# Altium schematic sheet POWER.SchDoc: XC7A3G-REGULATORS
size A4; Date: 9 AUG 2026; Engineer: Parsa Malekpour; Revision: 1.0.0; SheetNumber: 9; SheetTotal: 18
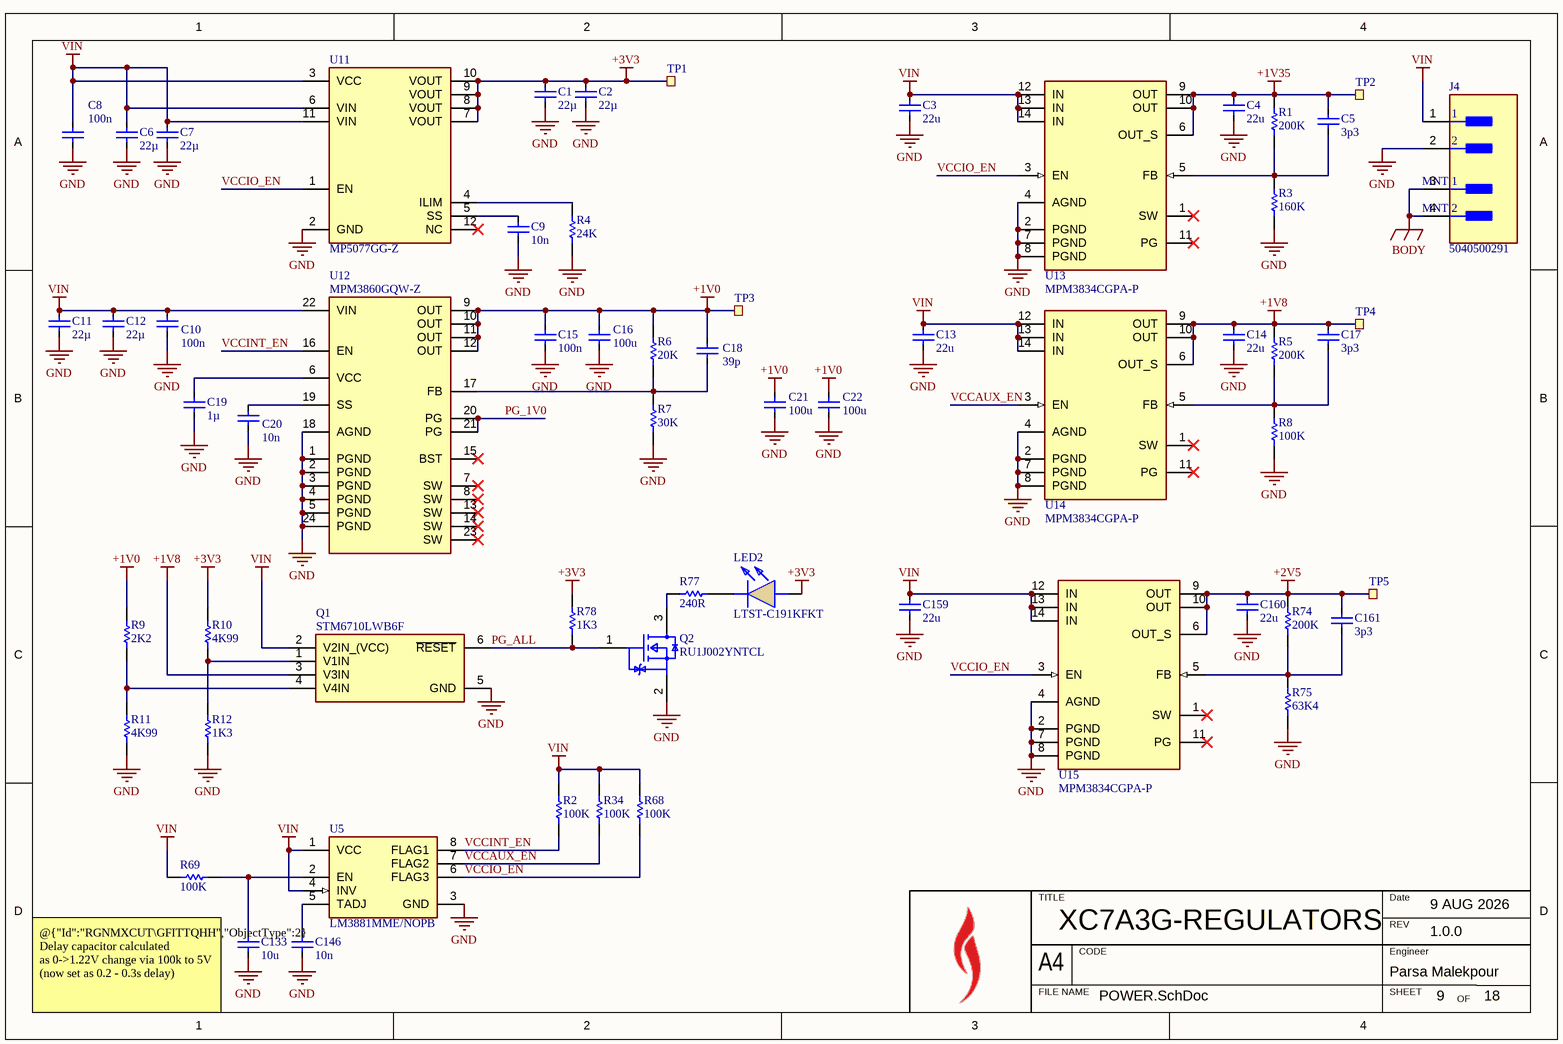
[diagram p0: POWER.SchDoc]

## Parts
C1  value 22µ  [CAPC1608X100X20LL10]  (hidden comment: C1608X5R0J226M080AC)
C2  value 22µ  [CAPC1608X100X20LL10]  (hidden comment: C1608X5R0J226M080AC)
C3  value 22u  [CAPC1608X100X20LL10]  (hidden comment: C1608X5R0J226M080AC)
C4  value 22u  [CAPC1608X100X20LL10]  (hidden comment: C1608X5R0J226M080AC)
C5  value 3p3  [CAPC1005X55N]  (hidden comment: CGA2B2C0G1H3R3C050BA)
C6  value 22µ  [CAPC1608X100X20LL10]  (hidden comment: C1608X5R0J226M080AC)
C7  value 22µ  [CAPC1608X100X20LL10]  (hidden comment: C1608X5R0J226M080AC)
C8  value 100n  [FP-C1005-050-0_05-IPC_C]  (hidden comment: C1005X7R1H104K050BB)
C9  value 10n  [FP-C1005-050-0_05-IPC_C]  (hidden comment: C1005X7S2A103K050BB)
C10  value 100n  [FP-C1005-050-0_05-IPC_C]  (hidden comment: C1005X7R1H104K050BB)
C11  value 22µ  [CAPC1608X100X20LL10]  (hidden comment: C1608X5R0J226M080AC)
C12  value 22µ  [CAPC1608X100X20LL10]  (hidden comment: C1608X5R0J226M080AC)
C13  value 22u  [CAPC1608X100X20LL10]  (hidden comment: C1608X5R0J226M080AC)
C14  value 22u  [CAPC1608X100X20LL10]  (hidden comment: C1608X5R0J226M080AC)
C15  value 100n  [FP-C1005-050-0_05-IPC_C]  (hidden comment: C1005X7R1H104K050BB)
C16  value 100u  [FP-C3216-160-0_3-IPC_B]  (hidden comment: C3216X5R0G107M160AB)
C17  value 3p3  [CAPC1005X55N]  (hidden comment: CGA2B2C0G1H3R3C050BA)
C18  value 39p  [FP-C1005-050-0_05-IPC_C]  (hidden comment: C1005C0G1H390J050BA)
C19  value 1µ  [CAPC1005X55X10NL05]  (hidden comment: C1005X5R1A105K050BB)
C20  value 10n  [FP-C1005-050-0_05-IPC_C]  (hidden comment: C1005X7S2A103K050BB)
C21  value 100u  [FP-C3216-160-0_3-IPC_B]  (hidden comment: C3216X5R0G107M160AB)
C22  value 100u  [FP-C3216-160-0_3-IPC_B]  (hidden comment: C3216X5R0G107M160AB)
C133  value 10u  [FP-C1608-080-0_1-IPC_C]  (hidden comment: C1608JB0J106K080AB)
C146  value 10n  [FP-C1005-050-0_05-IPC_C]  (hidden comment: C1005X7S2A103K050BB)
C159  value 22u  [CAPC1608X100X20NL10]  (hidden comment: C1608X5R0J226M080AC)
C160  value 22u  [CAPC1608X100X20LL10]  (hidden comment: C1608X5R0J226M080AC)
C161  value 3p3  [CAPC1005X55N]  (hidden comment: CGA2B2C0G1H3R3C050BA)
J4  5040500291  [FP-5040500291-MFG]
LED2  LTST-C191KFKT  [LEDC1608X55N]
Q1  STM6710LWB6F  [SOT95P280X145-6N]
Q2  RU1J002YNTCL  [FP-UMT3F-MFG]
R1  value 200K  [RESC1005X40X25NL05T10]  (hidden comment: RC0402FR-07200KL)
R2  value 100K  [RESC1005X40X25LL05T10]  (hidden comment: RC0402FR-07100KL)
R3  value 160K  [RESC1005X40X25NL05T10]  (hidden comment: RC0402FR-07160KL)
R4  value 24K  [RESC1005X40X25LL05T10]  (hidden comment: RC0402FR-0724KL)
R5  value 200K  [RESC1005X40X25LL05T10]  (hidden comment: RC0402FR-07200KL)
R6  value 20K  [RESC1005X40X25LL05T10]  (hidden comment: RC0402FR-0720KL)
R7  value 30K  [RESC1005X40X25LL05T10]  (hidden comment: RC0402FR-0730KL)
R8  value 100K  [RESC1005X40X25LL05T10]  (hidden comment: RC0402FR-07100KL)
R9  value 2K2  [RESC1005X40X25LL05T10]  (hidden comment: RC0402FR-072K2L)
R10  value 4K99  [RESC1005X40X25LL05T10]  (hidden comment: RC0402FR-074K99L)
R11  value 4K99  [RESC1005X40X25LL05T10]  (hidden comment: RC0402FR-074K99L)
R12  value 1K3  [RESC1005X40X25LL05T10]  (hidden comment: RC0402FR-071K3L)
R34  value 100K  [RESC1005X40X25LL05T10]  (hidden comment: RC0402FR-07100KL)
R68  value 100K  [RESC1005X40X25LL05T10]  (hidden comment: RC0402FR-07100KL)
R69  value 100K  [RESC1005X40X25NL05T10]  (hidden comment: RC0402FR-07100KL)
R74  value 200K  [RESC1005X40X25NL05T10]  (hidden comment: RC0402FR-07200KL)
R75  value 63K4  [RESC1005X40X25ML05T10]  (hidden comment: RC0402FR-0763K4L)
R77  value 240R  [RESC1005X40X25LL05T10]  (hidden comment: RC0402FR-07240RL)
R78  value 1K3  [RESC1005X40X25LL05T10]  (hidden comment: RC0402FR-071K3L)
TP1  Ø1.0mm,SMD  [TP_SMD_Ø1.0mm]  (value not drawn)  (no BOM)
TP2  Ø1.0mm,SMD  [TP_SMD_Ø1.0mm]  (value not drawn)  (no BOM)
TP3  Ø1.0mm,SMD  [TP_SMD_Ø1.0mm]  (value not drawn)  (no BOM)
TP4  Ø1.0mm,SMD  [TP_SMD_Ø1.0mm]  (value not drawn)  (no BOM)
TP5  Ø1.0mm,SMD  [TP_SMD_Ø1.0mm]  (value not drawn)  (no BOM)
U5  LM3881MME/NOPB  [FP-DGK0008A-MFG]
U11  MP5077GG-Z  [MP5077GGZ]
U12  MPM3860GQW-Z  [MPM3650CGQWZ]
U13  MPM3834CGPA-P  [MPM3834CGPAP]
U14  MPM3834CGPA-P  [MPM3834CGPAP]
U15  MPM3834CGPA-P  [MPM3834CGPAP]

## Nets
+1V0: C15.1 C16.2 C18.2 C21.2 C22.2 R6.1 R9.1 TP3.1 U12.9(OUT) U12.10(OUT) U12.11(OUT) U12.12(OUT)
+1V8: C14.1 C17.1 Q1.3(V3IN) R5.1 TP4.1 U14.6(OUT_S) U14.9(OUT) U14.10(OUT)
+1V35: C4.1 C5.1 R1.1 TP2.1 U13.6(OUT_S) U13.9(OUT) U13.10(OUT)
+2V5: C160.1 C161.1 R74.1 TP5.1 U15.6(OUT_S) U15.9(OUT) U15.10(OUT)
+3V3: C1.1 C2.1 LED2.2(A) R10.1 R78.1 TP1.1 U11.7(VOUT) U11.8(VOUT) U11.9(VOUT) U11.10(VOUT)
BODY: J4.3(MNT_1) J4.4(MNT_2)
GND: C1.2 C2.2 C3.2 C4.2 C6.2 C7.2 C8.1 C9.2 C10.1 C11.2 C12.2 C13.2 C14.2 C15.2 C16.1 C19.2 C20.1 C21.1 C22.1 C133.2 C146.2 C159.2 C160.2 J4.2 Q1.5(GND) Q2.2(S) R3.2 R4.2 R7.2 R8.2 R11.2 R12.1 R75.2 U5.3(GND) U11.2(GND) U12.1(PGND) U12.2(PGND) U12.3(PGND) U12.4(PGND) U12.5(PGND) U12.18(AGND) U12.24(PGND) U13.2(PGND) U13.4(AGND) U13.7(PGND) U13.8(PGND) U14.2(PGND) U14.4(AGND) U14.7(PGND) U14.8(PGND) U15.2(PGND) U15.4(AGND) U15.7(PGND) U15.8(PGND)
VIN: C3.1 C6.1 C7.1 C8.2 C10.2 C11.1 C12.1 C13.1 C159.1 J4.1 Q1.2(V2IN_(VCC)) R2.1 R34.1 R68.1 R69.1 U5.1(VCC) U5.4(INV) U11.3(VCC) U11.6(VIN) U11.11(VIN) U12.22(VIN) U13.12(IN) U13.13(IN) U13.14(IN) U14.12(IN) U14.13(IN) U14.14(IN) U15.12(IN) U15.13(IN) U15.14(IN)
PG_1V0: U12.20(PG) U12.21(PG)
PG_ALL: Q1.6(~{RESET}) Q2.1(G) R78.2
VCCAUX_EN: R34.2 U5.7(FLAG2) U14.3(EN)
VCCINT_EN: R2.2 U5.8(FLAG1) U12.16(EN)
VCCIO_EN: R68.2 U5.6(FLAG3) U11.1(EN) U13.3(EN) U15.3(EN)
NetC5_2: C5.2 R1.2 R3.1 U13.5(FB)
NetC9_1: C9.1 U11.5(SS)
NetC17_2: C17.2 R5.2 R8.1 U14.5(FB)
NetC18_1: C18.1 R6.2 R7.1 U12.17(FB)
NetC19_1: C19.1 U12.6(VCC)
NetC20_2: C20.2 U12.19(SS)
NetC133_1: C133.1 R69.2 U5.2(EN)
NetC146_1: C146.1 U5.5(TADJ)
NetC161_2: C161.2 R74.2 R75.1 U15.5(FB)
NetLED2_1: LED2.1(K) R77.1
NetQ1_1: Q1.1(V1IN) R10.2 R12.2
NetQ1_4: Q1.4(V4IN) R9.2 R11.1
NetQ2_3: Q2.3(D) R77.2
NetR4_1: R4.1 U11.4(ILIM)

Not connected (* = marked no-connect by the designer): U11 12(NC)*; U12 7(SW)* 8(SW)* 13(SW)* 14(SW)* 15(BST)* 23(SW)*; U13 1(SW)* 11(PG)*; U14 1(SW)* 11(PG)*; U15 1(SW)* 11(PG)*

## Notes on the sheet
- @{"Id":"RGNMXCUT\GFITTQHH","ObjectType":2} Delay capacitor calculated
  as 0->1.22V change via 100k to 5V
  (now set as 0.2 - 0.3s delay)
- TITLE
- REV
- Date
- A4
- FILE NAME
- CODE
- SHEET
- Engineer
- OF

## Library data of the parts
C1-C4 C6 C7 C11-C14 C159 C160 = C1608X5R0J226M080AC: MLCC 22 uF, ±20%, 6.3 V, -55 to 85 degC, 1608 (0603 Metric), RoHS, Tape and Reel; PCN Part Number: MLCCPartNumberChange30/Nov/2012; Manufacturer: TDK; Temperature Coefficient: X5R; Product Training Modules: CSeriesGeneralApplicationsSEAT,CCV,andTVCLDesignToolsGuidetoReplacinganElectrolyticCapacitorwithanMLCC; Other Names: 445-8028-1; Voltage - Rated: 6.3V; Design Resources: 20WNon-IsolatedBuckLEDDriverUsingPLLNK460KG; Online Catalog: CSeries,GeneralPurpose; Kits: 445-9003-KIT-ND-KITCAPCERHICAPMLCCSMD; Tolerance: ±20%; Series: C; Thickness (Max): 0.039"(1.00mm); Mounting Type: SurfaceMount,MLCC; Ratings: -; Datasheet Version: Mar-15; Package Reference: 603; Packaging: CutTape(CT); Features: -; Package / Case: 0603(1608Metric); Family: CeramicCapacitors; Lead Spacing: -; RoHS Information: RoHSCertificate-MLCC; Manufacturer URL: http://www.tdk.com/; Lead Style: -; Category: Capacitors; Applications: GeneralPurpose; Package Description: 2-Pin Surface Mount Device, Body 1.6 x 0.8 mm; Standard Package: 1; Datasheet URL: http://www.farnell.com/datasheets/1913358.pdf; Height - Seated (Max): -; Operating Temperature: -55degC~85degC; Size / Dimension: 0.063"Lx0.031"W(1.60mmx0.80mm)
C5 C17 C161 = CGA2B2C0G1H3R3C050BA: Capacitor; Manufacturer_Name: TDK; Datasheet Link: http://docs-europe.electrocomponents.com/webdocs/14e9/0900766b814e9125.pdf; Height: 0.55mm; Part Number: CGA2B2C0G1H3R3C050BA
C8 C10 C15 = C1005X7R1H104K050BB: MLCC 100nF ±10% 50V X7R SMD 0402; Dielectric Material: Ceramic; Voltage: 50V; Min Operating Temperature: -55°C; Depth: 0.5mm; Radiation Hardening: No; RoHS Compliant: Yes; Voltage Rating (DC): 50V; Lead Free: Lead Free; Resistor Type: Ceramic; Height: 0.5mm; Dielectric: X7R; Thickness: 0.022inch; Case/Package: 0402; Case Code (Metric): 1005; Termination: SMD/SMT; Packaging: Tape and Reel; Max Operating Temperature: 125°C; Mount: Surface Mount; Package Quantity: 1; Width: 0.02inch; Weight: 2.3E-05oz; Voltage Rating: 50V; Tolerance: 10%; Construction: Flat; Case Code (Imperial): 0402; Length: 1mm; REACH SVHC: No SVHC; Series: C; Part Number: C1005X7R1H104K050BB
C9 C20 C146 = C1005X7S2A103K050BB: MLCC 10nF ±10% 100V X7S SMD 0402; Dielectric Material: Ceramic; Dissipation Factor: 5%; Case Code (Imperial): 0402; Packaging: Tape and Reel; Voltage Rating (DC): 100V; Max Operating Temperature: 125°C; Min Operating Temperature: -55°C; Case Code (Metric): 1005; Weight: 2.3E-05oz; Length: 1mm; Width: 0.02inch; Tolerance: 10%; Series: C; Package Quantity: 1; RoHS Compliant: Yes; Voltage: 100V; Resistor Type: Ceramic; Number of Pins: 2; Mount: Surface Mount; Height: 0.5mm; Termination: SMD/SMT; Dielectric: X7S; Thickness: 0.022inch; REACH SVHC: No SVHC; Lead Free: Lead Free; Voltage Rating: 100V; Case/Package: 0402; Depth: 0.5mm; Part: *; Part Number: C1005X7S2A103K050BB
C16 C21 C22 = C3216X5R0G107M160AB: MLCC 100uF ±20% 4V X5R SMD 1206; Dielectric Material: Ceramic; Dielectric: X5R; Voltage Rating (DC): 4V; Lead Free: Lead Free; Max Operating Temperature: 85°C; Construction: Flat; Termination: SMD/SMT; Mount: Surface Mount; Thickness: 0.071inch; Height: 1.6mm; Width: 0.063inch; Resistor Type: Ceramic; Radiation Hardening: No; Case/Package: 1206; Series: C; Weight: 0.000571oz; Depth: 1.6mm; RoHS Compliant: Yes; Package Quantity: 2000; Case Code (Metric): 3216; Length: 3.2mm; Case Code (Imperial): 1206; Tolerance: 20%; Packaging: Tape and Reel; Voltage Rating: 4V; Min Operating Temperature: -55°C; Part Number: C3216X5R0G107M160AB
C18 = C1005C0G1H390J050BA: MLCC 39pF ±5% 50V C0G SMD 0402; Dielectric Material: Ceramic; Max Operating Temperature: 125°C; Voltage Rating: 50V; Height: 0.5mm; Tolerance: 5%; Width: 0.02inch; Mount: Surface Mount; Thickness: 0.022inch; Package Quantity: 1; Length: 1mm; Voltage Rating (DC): 50V; Case Code (Metric): 1005; Depth: 0.5mm; Series: C; Construction: Flat; Case/Package: 0402; Lead Free: Lead Free; RoHS Compliant: Yes; Termination: SMD/SMT; Radiation Hardening: No; Packaging: Tape and Reel; Min Operating Temperature: -55°C; Dielectric: C0G; Case Code (Imperial): 0402; Weight: 2.3E-05oz; Part Number: C1005C0G1H390J050BA
C19 = C1005X5R1A105K050BB: MLCC 1 uF, +/- 10%, 10 V, -55 to 85 degC, 0402 (1005 Metric), RoHS, Tape and Reel; Manufacturer: TDK; PCN Part Number: MLCCPartNumberChange30/Nov/2012; Product Training Modules: CSeriesGeneralApplicationsSEAT,CCV,andTVCLDesignToolsGuidetoReplacinganElectrolyticCapacitorwithanMLCC; Voltage - Rated: 10V; Temperature Coefficient: X5R; Online Catalog: CSeries,GeneralPurpose; Other Names: 445-4114-6; Category: Capacitors; Features: -; Lead Style: -; RoHS Information: RoHSCertificate-MLCC; Manufacturer URL: http://www.tdk.com/; Lead Spacing: -; Thickness (Max): 0.022"(0.55mm); Applications: GeneralPurpose; Tolerance: ±10%; Mounting Technology: SurfaceMount; Mounting Type: SurfaceMount,MLCC; Operating Temperature: -55°C~85°C; Datasheet URL: http://download.siliconexpert.com/pdfs/2015/4/21/15/54/45/779/tdk_/manual/37024850441143360mlcc_commercial_general_en.pdf; Package Reference: 1005; Height - Seated (Max): -; Family: CeramicCapacitors; Datasheet Version: 03/2015; Package Description: 2-Pin Surface Mount Device, Body 1 x 0.5 mm; Packaging: Digi-Reel®; Size / Dimension: 0.039"Lx0.020"W(1.00mmx0.50mm); Standard Package: 1; Package / Case: 0402(1005Metric); Ratings: -; Series: C; Part Number: C1005X5R1A105K050BB
C133 = C1608JB0J106K080AB: MLCC 10μF ±10% 6.3V JB SMD 0603; Dielectric Material: Ceramic; Case Code (Imperial): 0603; Thickness: 0.035inch; Min Operating Temperature: -25°C; Termination: SMD/SMT; Lead Free: Lead Free; Resistor Type: Ceramic; Width: 0.8mm; Voltage Rating (DC): 6.3V; Package Quantity: 4000; Tolerance: 10%; Length: 0.063inch; Series: C; Height: 0.8mm; Max Operating Temperature: 85°C; Mount: Surface Mount; RoHS Compliant: Yes; Voltage Rating: 6.3V; Case Code (Metric): 1608; Case/Package: 0603; Packaging: Tape and Reel
J4 = 5040500291: CONN HEADER SMD R/A 2POS 1.5MM; Manufacturer: Molex; Current Rating: 3.5A; Conn Orientation: Right Angle; Conn Gender: Male; Number Of Contacts: 2; Voltage Rating: 150V; Lead Free: Yes; Contact Material: Gold,Nickel; Manufacturer Part Number: 5040500291; Digikey Description: CONN HEADER SMD R/A 2POS 1.5MM; Temperature: -40°C to +105°C; Category: Conn; Device Class L3: unset; Automotive: No; Device Class L1: Connectors; Number Of Rows: 1; Octopart: https://octopart.com/504050-0291-molex-99548498; Pitch: 1.5mm; Footprint Url: https://www.molex.com/pdm_docs/sd/5040500291_sd.pdf; ComponentLink2Description: Datasheet; ComponentLink2URL: https://www.molex.com/webdocs/datasheets/pdf/en-us/5040500291_PCB_HEADERS.pdf; Height: 2.15mm; RoHS: TRUE; Temperature Range High: +105°C; Device Class L2: Headers and Wire Housings; Temperature Range Low: -40°C; Package: 0
LED2 = LTST-C191KFKT: LED; Manufacturer: Lite-On; Value: Orange; Datasheet Link: https://datasheet.datasheetarchive.com/originals/distributors/Datasheets-305/79307.pdf; Height: 0.55mm; Mouser Part Number: 859-LTST-C191KFKT; Mouser Price/Stock: https://www.mouser.co.uk/ProductDetail/Lite-On/LTST-C191KFKT?qs=1bx9pL%2Fk%252BiAv01YAc0eitQ%3D%3D; Arrow Part Number: LTST-C191KFKT; Arrow Price/Stock: https://www.arrow.com/en/products/ltst-c191kfkt/lite-on-technology.html?utm_currency=USD&region=nac; Part Number: LTST-C191KFKT
Q1 = STM6710LWB6F: Transistor; Manufacturer_Name: STMicroelectronics; Datasheet Link: https://www.st.com/resource/en/datasheet/stm6710.pdf; Height: 1.45mm; Manufacturer_Part_Number: STM6710LWB6F; Mouser Part Number: 511-STM6710LWB6F; Mouser Price/Stock: https://www.mouser.co.uk/ProductDetail/STMicroelectronics/STM6710LWB6F?qs=asv7t3zdqdgT54rODYaRqg%3D%3D; Arrow Part Number: STM6710LWB6F; Arrow Price/Stock: https://www.arrow.com/en/products/stm6710lwb6f/stmicroelectronics
Q2 = RU1J002YNTCL: MOSFET N-CH 50V 0.2A UMT3F; Manufacturer: Rohm; Drain To Source Resistance: 1.6Ω; Depletion Mode: False; Continuous Drain Current: 200mA; Pulse Drain Current: 800mA; Turn On Delay Time: 5ns; Threshold Vgs Max: 0.8V; Rthja Max: 833°C/W; Max Forward Diode Voltage: 1.2V; Max Junction Temp: +150°C; Standoff Height: 0mm; Input Capacitace At Vds: 26pF @ 10V; Number Of Channels: 1; Power Dissipation: 150mW; Gate To Source Voltage: 8V; Turn Off Delay Time: 17ns; Threshold Vgs Min: 0.3V; Lead Free: Yes; Device Class L3: MOSFETs; Drain To Source Voltage: 50V; ComponentLink2URL: https://d1d2qsbl8m0m72.cloudfront.net/en/products/databook/datasheet/discrete/transistor/mosfet/ru1j002yn-e.pdf; RoHS: TRUE; Device Class L2: Transistors; Mouser Description: MOSFET 0.9V Drive Nch MOSFET; Category: Trans; Octopart: https://octopart.com/ru1j002yntcl-rohm-47197697; Temperature: to +150°C; Height: 1.05mm; Number Of N Channels: 1; Package: UMT3F; ComponentLink2Description: Datasheet; Automotive: No; Drain To Source Breakdown Voltage: 50V; Device Class L1: Discrete Semiconductors; Digikey Description: MOSFET N-CH 50V 0.2A UMT3F; Manufacturer Part Number: RU1J002YNTCL; Temperature Range High: +150°C
R1 R5 R74 = RC0402FR-07200KL: Manufacturer: Yageo / Phycomp; Part Number: RC0402FR-07200KL; Parameter 1: *
R2 R8 R34 R68 R69 = RC0402FR-07100KL: Manufacturer: Yageo / Phycomp; Part Number: RC0402FR-07100KL
R3 = RC0402FR-07160KL: Manufacturer: Yageo / Phycomp; Part Number: RC0402FR-07160KL
R4 = RC0402FR-0724KL: Manufacturer: Yageo / Phycomp; Part Number: RC0402FR-0724KL
R6 = RC0402FR-0720KL: Manufacturer: Yageo / Phycomp; Part Number: RC0402FR-0720KL; Parameter 1: *
R7 = RC0402FR-0730KL: Manufacturer: Yageo / Phycomp; Part Number: RC0402FR-0730KL; Parameter 1: *
R9 = RC0402FR-072K2L: Manufacturer: Yageo / Phycomp; Part Number: RC0402FR-072K2L
R10 R11 = RC0402FR-074K99L: Manufacturer: Yageo / Phycomp; Part Number: RC0402FR-074K99L
R12 R78 = RC0402FR-071K3L: Manufacturer: Yageo / Phycomp; Part Number: RC0402FR-071K3L
R75 = RC0402FR-0763K4L: Manufacturer: Yageo / Phycomp; Part Number: RC0402FR-0763K4L
R77 = RC0402FR-07240RL: 240R 0.063W 1% 0402 (1005 Metric)  SMD; Case-Metric: 1005; Case-EIA: 0402; Power: 0.063 W; Tolerance: 1 %; Technology: SMT; Part Number: RC0402FR-07240RL; Parameter 1: *
TP1-TP5 = TP_SMD_Ø1.0MM: 1.0mm circular SMD testpad; Manufacturer: Nordic Semiconductor; Manufacturer Part Number: N.A.; Pad Count: 1; Part Number: TP_SMD_Ø1.0MM; LatestRevisionDate: 2013-06-11; Published: 2013-06-11; Value: Ø1.0mm,SMD; Note: N.A.; Artikkelnr Noca: N.A.; Footprint Doc: TP_SMD_Ø1.0mm; Part number IPS: N.A.; ComponentLink1URL: N.A.; ComponentLink1Description: Datasheet; ComponentLink2URL: N.A.; ComponentLink2Description: Supplier link; HelpURL: N.A.; Supplier 1: N.A.; Supplier Part Number 1: N.A.; Supplier 2: N.A.; Supplier Part Number 2: N.A.; Component Class: Connectors; PartId: 100500475
U5 = LM3881MME/NOPB: IC POWER SUPPLY SEQUENCER 8VSSOP; Manufacturer: Texas Instruments; Standoff Height: 0.05mm; Max Supply Voltage: 5.5V; Reset Timeout: 9.6ms; Nominal Supply Current: 80uA; Output Current: 0.001uA; Reset Type: Active Low,Active High; Max Junction Temp: +125°C; Number Of Outputs: 3; Number Of Rails Monitored: 1; Min Supply Voltage: 2.7V; Threshold Voltage: 1.22V; Footprint 2 Description: TSOP, 8-Leads, Body 3x3mm, Pitch 0.65mm, IPC Low Density; Manufacturer Part Number: LM3881MME/NOPB; Package: DGK0008A; Digikey Description: IC POWER SUPPLY SEQUENCER 8VSSOP; Temperature Range Low: -40°C; Mouser Description: 3 Rail Simple Power Sequencer with Adjustable Time Delay 8-VSSOP -40 to 125; Temperature: -40°C to +125°C; ComponentLink2Description: Datasheet; Category: IC; ComponentLink2URL: http://www.ti.com/lit/ds/symlink/lm3881.pdf; Device Class L1: Integrated Circuits (ICs); Device Class L2: Power Management ICs; Temperature Range High: +125°C; Footprint 0 Description: TSOP, 8-Leads, Body 3x3mm, Pitch 0.65mm, IPC Medium Density; Octopart: https://octopart.com/lm3881mme%2Fnopb-texas+instruments-24814197; RoHS: TRUE; Ipc Land Pattern Name: SOP65P300X110-8; Footprint 1 Description: TSOP, 8-Leads, Body 3x3mm, Pitch 0.65mm, IPC High Density; Lead Free: Yes; Height: 1.1mm; Device Class L3: Voltage Supervisors; Automotive: No
U11 = MP5077GG-Z: Integrated Circuit; Manufacturer_Name: Monolithic Power Systems (MPS); Datasheet Link: http://www.monolithicpower.com/DesktopModules/DocumentManage/API/Document/getDocument?id=3265; Height: 1mm; Manufacturer_Part_Number: MP5077GG-Z; Mouser Part Number: 946-MP5077GG-Z; Mouser Price/Stock: https://www.mouser.co.uk/ProductDetail/Monolithic-Power-Systems-MPS/MP5077GG-Z?qs=AfGmtpoX2ghv3QovAD4CRg%3D%3D
U12 = MPM3860GQW-Z: Integrated Circuit; Manufacturer_Name: Monolithic Power Systems (MPS); Datasheet Link: https://www.monolithicpower.com/en/documentview/productdocument/index/version/2/document_type/Datasheet/lang/en/sku/MPM3860GQW-Z/document_id/8686/; Height: 1.65mm; Manufacturer_Part_Number: MPM3860GQW-Z; Mouser Part Number: 946-MPM3860GQW-Z; Mouser Price/Stock: https://www.mouser.co.uk/ProductDetail/Monolithic-Power-Systems-MPS/MPM3860GQW-Z?qs=vmHwEFxEFR%2FBBZgXfldbaA%3D%3D
U13-U15 = MPM3834CGPA-P: Integrated Circuit; Manufacturer_Name: Monolithic Power Systems (MPS); Datasheet Link: https://www.monolithicpower.com/en/documentview/productdocument/index/version/2/document_type/Datasheet/lang/en/sku/MPM3834CGPA/document_id/9651/; Height: 1.31mm; Manufacturer_Part_Number: MPM3834CGPA-P; Mouser Part Number: 946-MPM3834CGPA-P; Mouser Price/Stock: https://www.mouser.co.uk/ProductDetail/Monolithic-Power-Systems-MPS/MPM3834CGPA-P?qs=By6Nw2ByBD1gcNTTHPVSOg%3D%3D